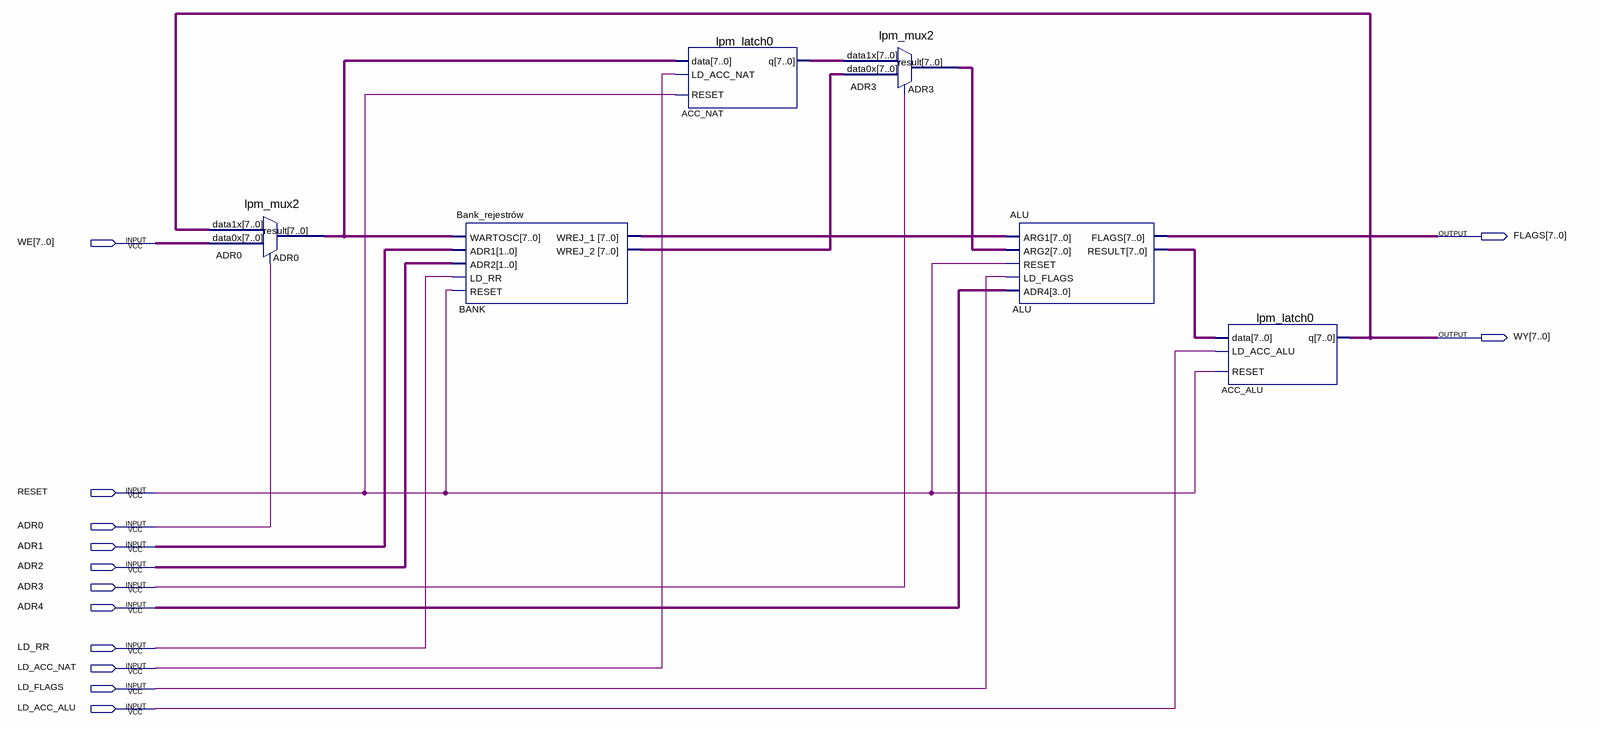
[diagram p0: schematic sheet]
// Quartus schematic Wykonawczy_2.bdf as structural Verilog: 6 symbols, 13 pins
module Wykonawczy_2 (
  input  [7:0] WE,
  input  RESET,
  input  ADR0,
  input  ADR1,
  input  ADR2,
  input  ADR3,
  input  ADR4,
  input  LD_RR,
  input  LD_ACC_NAT,
  input  LD_FLAGS,
  input  LD_ACC_ALU,
  output [7:0] FLAGS,
  output [7:0] WY
);

  wire [1:0] undriven, undriven_2;
  wire [3:0] undriven_3;
  wire [7:0] ACC_NAT_q, ADR0_result, ADR3_result, ALU_result, BANK_wrej_1, BANK_wrej_2;

  lpm_mux2 u_ADR0 (.data1x(WY), .data0x(WE), .ADR0(ADR0), .result(ADR0_result));
  \Bank_rejestrów  BANK (
    .WARTOSC(ADR0_result), .ADR1(undriven), .ADR2(undriven_2), .LD_RR(LD_RR), .RESET(RESET),
    .WREJ_1(BANK_wrej_1), .WREJ_2(BANK_wrej_2));
  lpm_latch0 ACC_NAT (.data(ADR0_result), .RESET(RESET), .LD_ACC_NAT(LD_ACC_NAT), .q(ACC_NAT_q));
  lpm_mux2 u_ADR3 (.data1x(ACC_NAT_q), .data0x(BANK_wrej_2), .ADR3(ADR3), .result(ADR3_result));
  ALU ALU (
    .ARG1(BANK_wrej_1), .ARG2(ADR3_result), .RESET(RESET), .LD_FLAGS(LD_FLAGS), .ADR4(undriven_3),
    .FLAGS(FLAGS), .RESULT(ALU_result));
  lpm_latch0 ACC_ALU (.data(ALU_result), .RESET(RESET), .LD_ACC_ALU(LD_ACC_ALU), .q(WY));
endmodule
